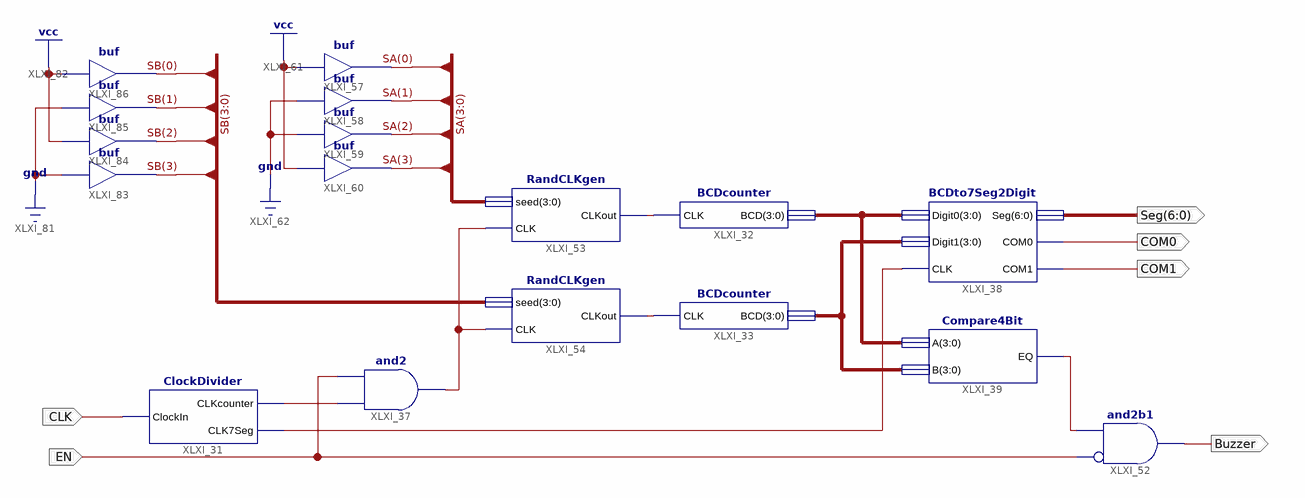
[diagram p0: schematic sheet 1]
// Xilinx ISE schematic DigitalDice.sch (spartan6) as structural Verilog: 17 symbols, 6 ports
module DigitalDice (
  input  EN,
  input  CLK,
  output Buzzer,
  output COM0,
  output COM1,
  output [6:0] Seg
);

  wire XLXN_79, XLXN_82, XLXN_88, XLXN_132, XLXN_133, XLXN_135;
  wire [3:0] SA, SB, XLXN_86, XLXN_87;

  BCDcounter XLXI_33 (.CLK(XLXN_133), .BCD(XLXN_86));
  RandCLKgen XLXI_54 (.seed(SB), .CLK(XLXN_135), .CLKout(XLXN_133));
  Compare4Bit XLXI_39 (.A(XLXN_87), .B(XLXN_86), .EQ(XLXN_88));
  BCDcounter XLXI_32 (.CLK(XLXN_132), .BCD(XLXN_87));
  RandCLKgen XLXI_53 (.seed(SA), .CLK(XLXN_135), .CLKout(XLXN_132));
  buf XLXI_60 (SA[3], 1'b1);
  buf XLXI_59 (SA[2], 1'b0);
  buf XLXI_58 (SA[1], 1'b0);
  buf XLXI_57 (SA[0], 1'b1);
  buf XLXI_83 (SB[3], 1'b0);
  buf XLXI_84 (SB[2], 1'b1);
  buf XLXI_85 (SB[1], 1'b0);
  buf XLXI_86 (SB[0], 1'b1);
  and XLXI_37 (XLXN_135, XLXN_82, EN);
  ClockDivider XLXI_31 (.ClockIn(CLK), .CLK7Seg(XLXN_79), .CLKcounter(XLXN_82));
  and XLXI_52 (Buzzer, ~EN, XLXN_88);  // and2b1
  BCDto7Seg2Digit XLXI_38 (.Digit0(XLXN_87), .Digit1(XLXN_86), .CLK(XLXN_79), .Seg(Seg), .COM1(COM1), .COM0(COM0));

  // Notes on the sheet:
  //   LOC on signal XLXN_124 = P47
endmodule
